# EasyEDA schematic tl071-preamp.json
TITLE: Sheet_1; REV: 1.0; Date: 2024-01-02; Sheet: 1/1; Company: Your Company
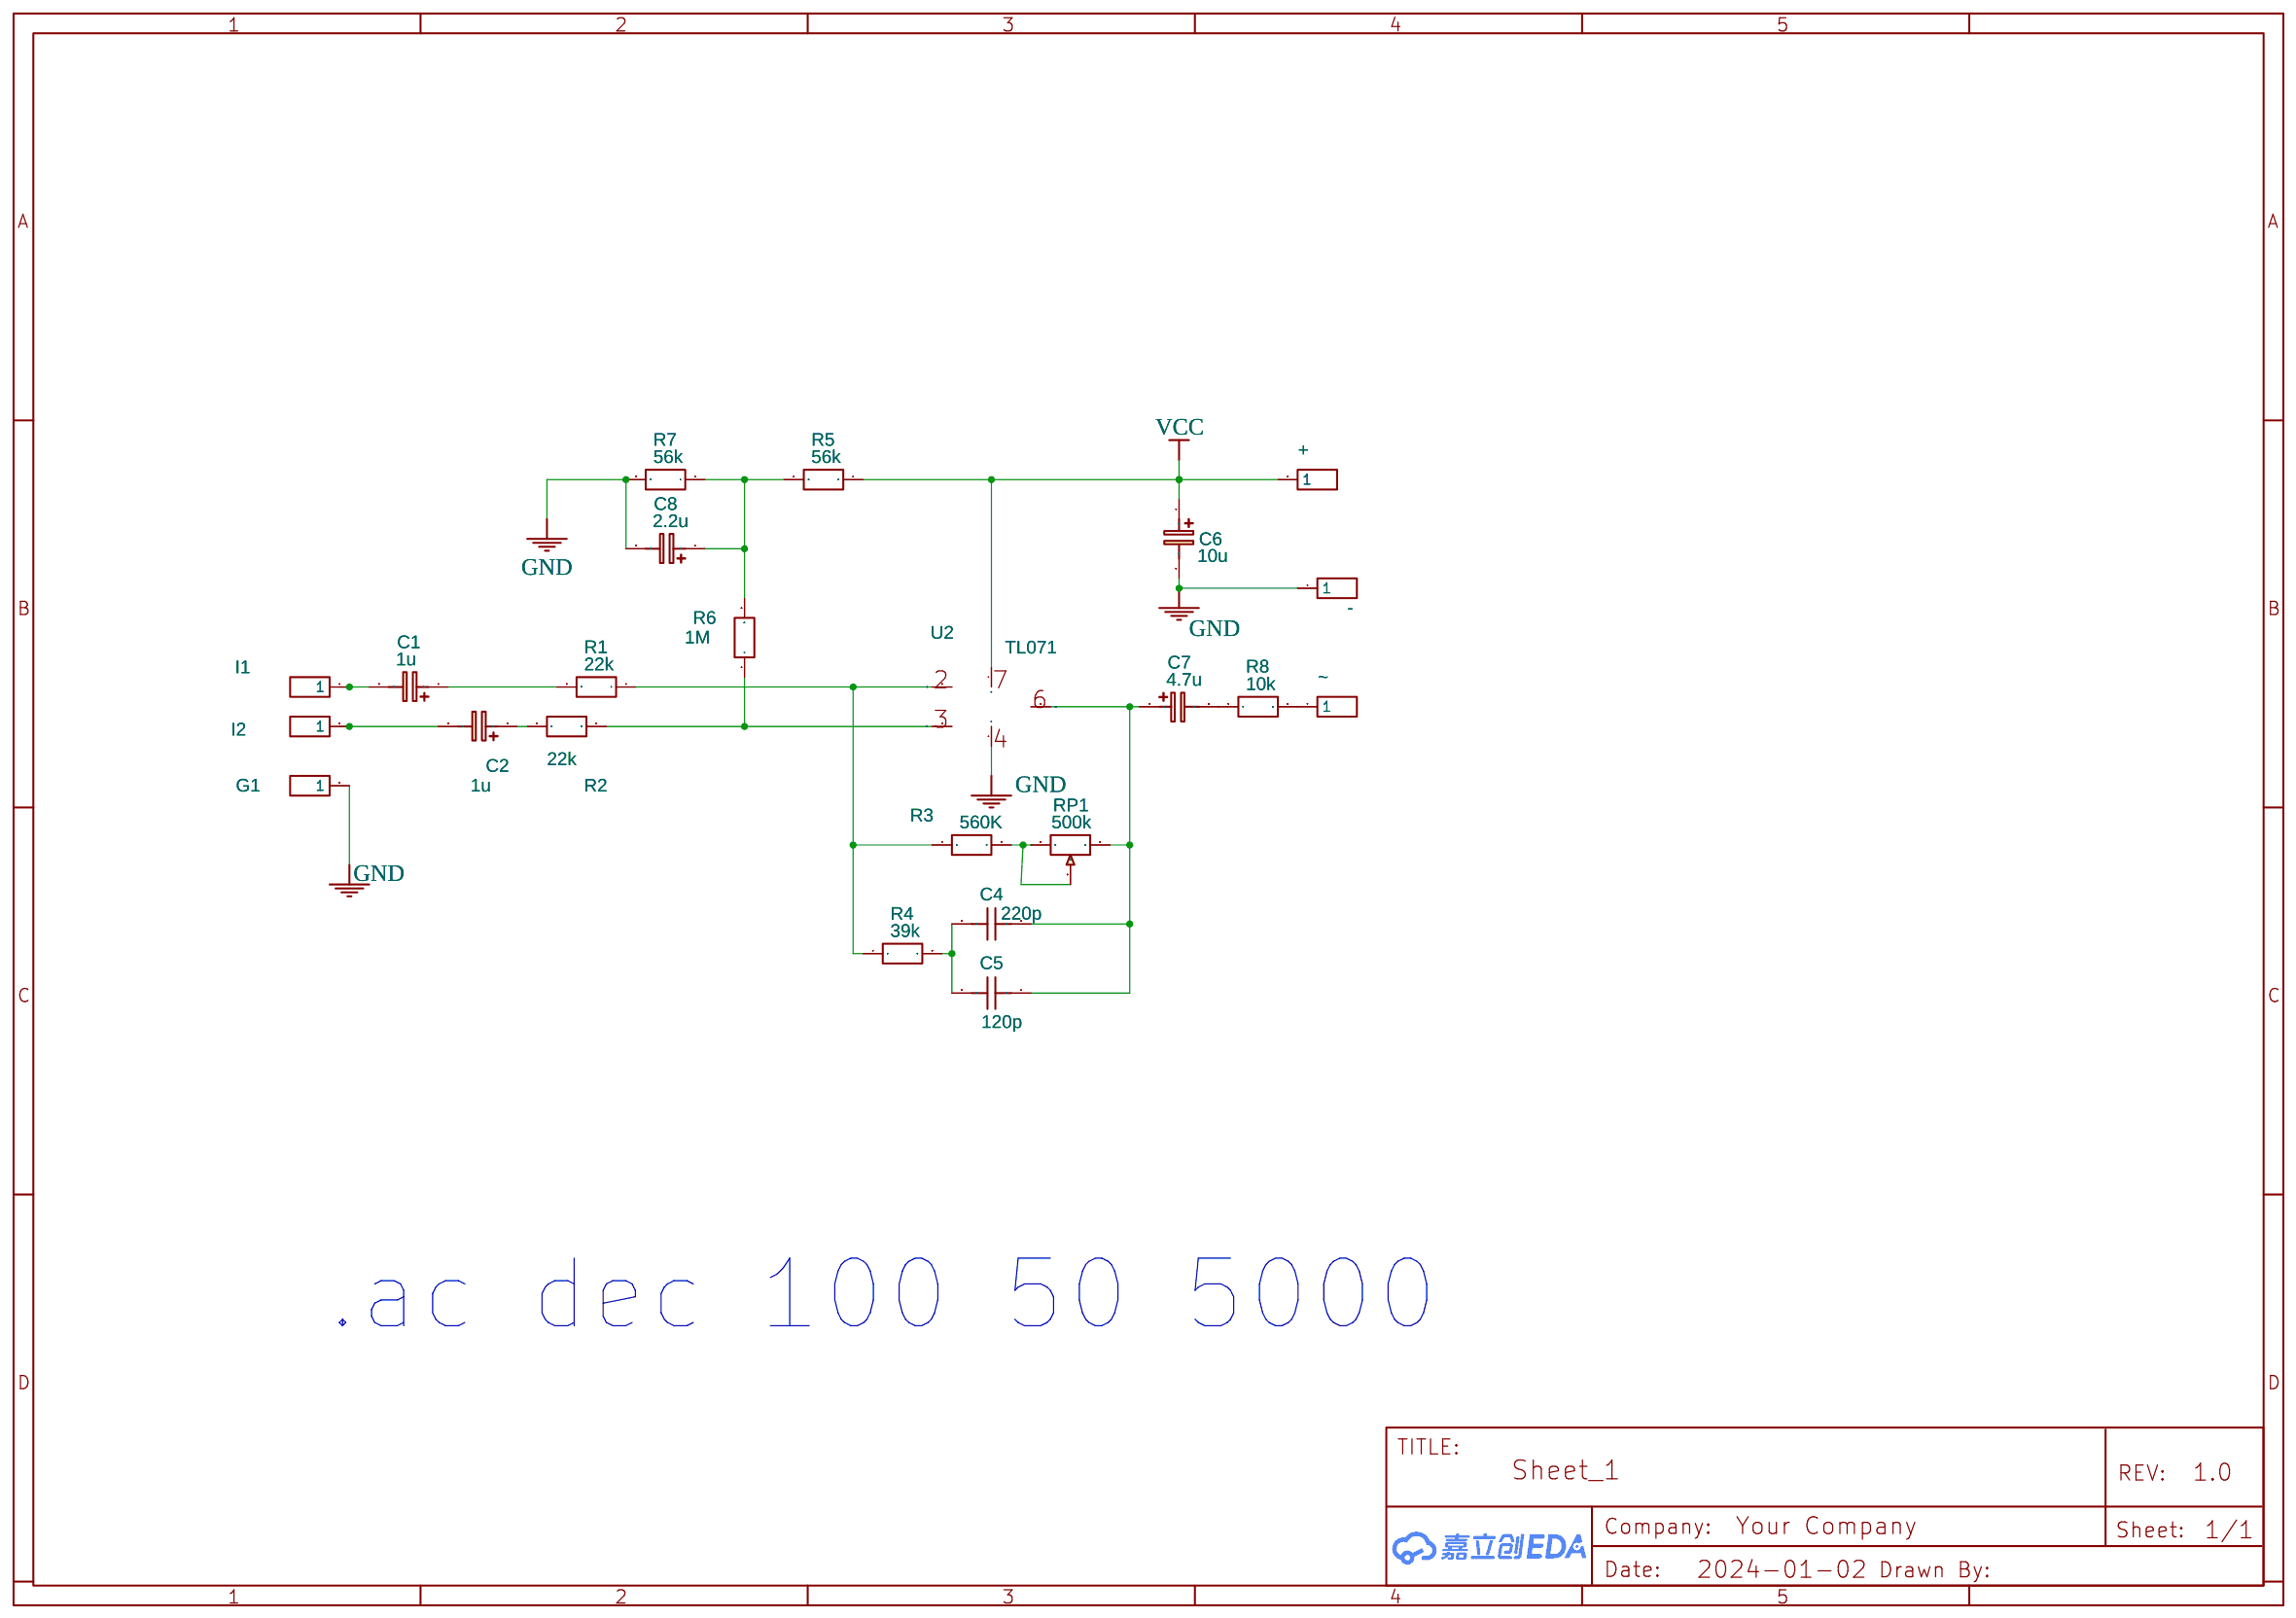
[diagram p0: schematic sheet]

## Parts
&#126;  O  [HDR-M-2.54_1X1]
+  O  [HDR-M-2.54_1X1]
-  O  [HDR-M-2.54_1X1]
C1  1u  [CASE-A_3216]
C2  1u  [CASE-A_3216]
C4  220p  [CASE-A_3216]
C5  120p  [CASE-A_3216]
C6  10u  [CASE-A_3216]
C7  4.7u  [CASE-A_3216]
C8  2.2u  [CASE-A_3216]
G1  O  [HDR-M-2.54_1X1]
I1  O  [HDR-M-2.54_1X1]
I2  O  [HDR-M-2.54_1X1]
R1  22k  [R0603]
R2  22k  [R0603]
R3  560K  [R0603]
R4  39k  [R0603]
R5  56k  [R0603]
R6  1M  [R0603]
R7  56k  [R0603]
R8  10k  [R0603]
RP1  500k  [RES-ADJ-TH_3362X]
U2  TL071  [TL071H]
~  O

## Library data of the parts
&#126; + - G1 I1 I2 = HDR-M-2.54_1x1: Supplier Part: C81276; Supplier: LCSC; Contributor: LCEDA_Lib
C1 C2 C6-C8 = C_Tan_SMD_A_EU: Contributor: LCEDA_Lib
C4 C5 = Capacitor_US: Contributor: EasyEDA; Supplier: YUJING; Capacitance: 1u
R1-R8 = R_0603_EU: Contributor: LCEDA_Lib
RP1 = R_3296W_EU: Supplier: LCSC; Contributor: LCEDA_Lib; Value(Ω): 10k
U2 = LM741: Contributor: juan_g2; sim: true
~ = HDR-M-2.54_1x1_2: BOM_Supplier Part: C81276; BOM_Supplier: LCSC

## Nets
GND: -.1 C6.2 C8.2 G1.1 R7.2 U2.4(V-)
VCC: +.1 C6.1 R5.1 U2.7(V+)
Net-(&#126;-1): &#126;.1 R8.2
Net-(C1-1): C1.1 R1.2
Net-(C1-2): C1.2 I1.1
Net-(C2-1): C2.1 R2.2
Net-(C2-2): C2.2 I2.1
Net-(C4-1): C4.1 C5.1 C7.1 RP1.1 U2.6(OUT)
Net-(C4-2): C4.2 C5.2 R4.2
Net-(C7-2): C7.2 R8.1
Net-(C8-1): C8.1 R5.2 R6.2 R7.1
Net-(R1-1): R1.1 R3.1 R4.1 U2.2(IN-)
Net-(R2-1): R2.1 R6.1 U2.3(IN+)
Net-(R3-2): R3.2 RP1.2 RP1.3

## Notes on the sheet
- .ac dec 100 50 5000
